# EAGLE design ch340 (EAGLE 7.7.0)
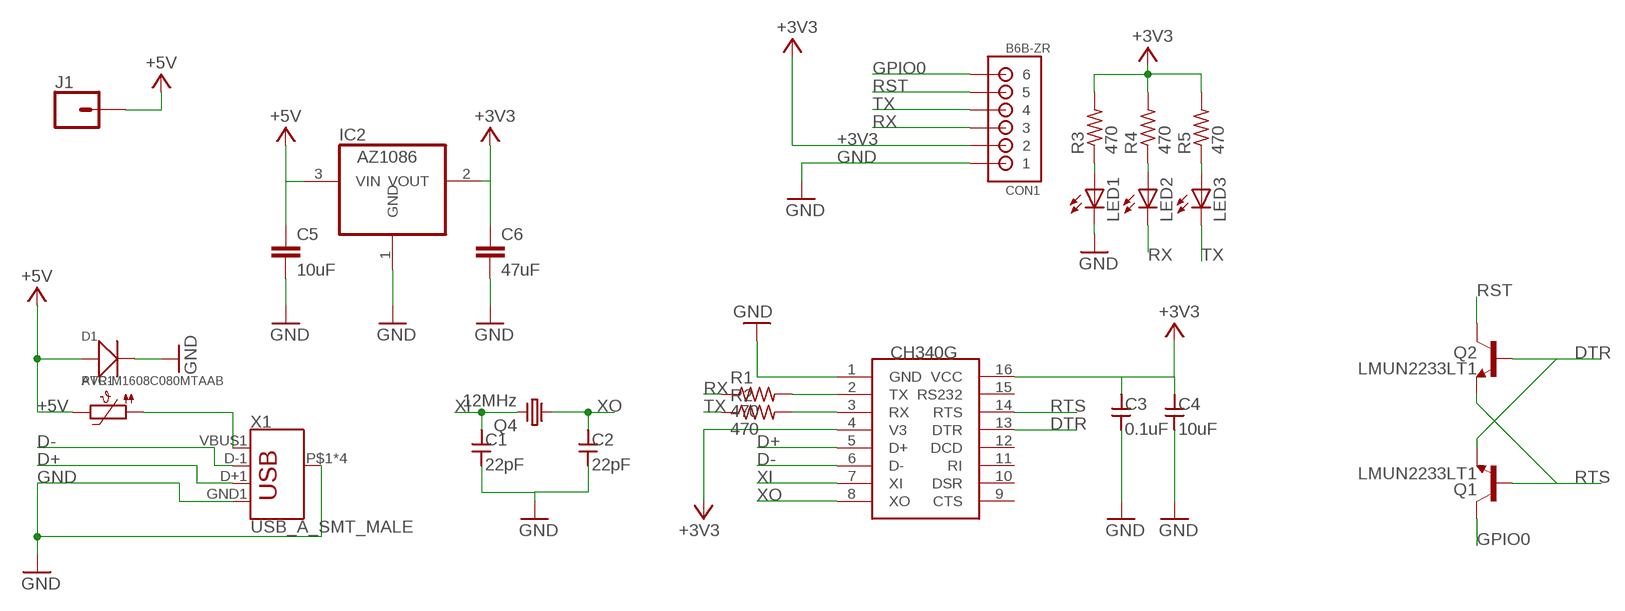
[diagram p0: schematic, sheet 1]

## Parts
C1  22pF  CAPACITOR1608  [SMD1608]
C2  22pF  CAPACITOR1608  [SMD1608]
C3  0.1uF  CAPACITOR1608  [SMD1608]
C4  10uF  CAPACITOR1608  [SMD1608]
C5  10uF  C-EUC0805  [C0805]
C6  47uF  C-EUC0805  [C0805]
CON1  B6B-ZR  [B6B-ZR]
D1  AVR-M1608C080MTAAB  DIODETUMD2  [TUMD2]
IC2  AZ1086  [SOT223]
J1  CONN_01PTH_NO_SILK_YES_STOP  [1X01_NO_SILK]
LED1  LEDCHIP-LED0805  [CHIP-LED0805]
LED2  LEDCHIP-LED0805  [CHIP-LED0805]
LED3  LEDCHIP-LED0805  [CHIP-LED0805]
PTC1  PTC1206  [1206]
Q1  LMUN2233LT1  [SOT23-3]
Q2  LMUN2233LT1  [SOT23-3]
Q4  12MHz  CRYSTAL-TC26H  [TC26H]
R1  470  R-US_R0603  [R0603]
R2  470  R-US_R0603  [R0603]
R3  470  R-US_R0603  [R0603]
R4  470  R-US_R0603  [R0603]
R5  470  R-US_R0603  [R0603]
U$1  CH340G  [SOIC16]
X1  USB_A_SMT_MALE  [USB-A-SMT-MALE]

## Nets
+3V3 [vcc]: C3.1 C4.1 C6.1 CON1.2 IC2.2(VOUT) R3.2 R4.2 R5.2 U$1.4(V3) U$1.16(VCC)
+5V [vcc]: C5.1 D1.+ IC2.3(VIN) J1.1 PTC1.2
D+: U$1.5(D+) X1.D+1(D+)
D-: U$1.6(D-) X1.D-1(D-)
DTR: Q1.3(E) Q2.1(B) U$1.13(DTR)
GND [gnd]: C1.2 C2.2 C3.2 C4.2 C5.2 C6.2 CON1.1 D1.- IC2.1(GND) LED1.C U$1.1(GND) X1.GND1(GND) X1.P$1(SHIELD) X1.P$2(SHIELD) X1.P$3(SHIELD) X1.P$4(SHIELD)
GPIO0: CON1.6 Q1.2(C)
N$1 [vcc]: PTC1.1 X1.VBUS1(VBUS)
N$2: LED1.A R3.1
N$3: LED2.A R4.1
N$4: LED3.A R5.1
RST: CON1.5 Q2.2(C)
RTS: Q1.1(B) Q2.3(E) U$1.14(RTS)
RX: CON1.3 LED2.C R1.1
RXD: R2.2 U$1.3(RX)
TX: CON1.4 LED3.C R2.1
TXD: R1.2 U$1.2(TX)
XI: C1.1 Q4.2 U$1.7(XI)
XO: C2.1 Q4.1 U$1.8(XO)
Unconnected: U$1.9(CTS) U$1.10(DSR) U$1.11(RI) U$1.12(DCD) U$1.15(RS232)

## Library data of the parts
C1-C4 = generic:CAPACITOR: Generic Capacitor
C5 C6 = resistor:C-EU: CAPACITOR, European symbol
CON1 = jst-zh:B6B-ZR: JST-ZH Connector 6 pol, 1.5mm pitch Package: B6B-ZR Source: http://www.jst-mfg.com/product/pdf/eng/eZH.pdf
D1 = for-esp32-breakout:DIODE*
IC2 = akizuki:AZ1086: 1.5A LOW DROPOUT LINEAR REGULATOR 1.8V, 2.5V, 2.85V, 3.3V, 5V, and Adj; MPN: AZ1086
J1 = SparkFun-Connectors:CONN_01: Single connection point. Often used as Generic Header-pin footprint for 0.1 inch spaced/style header connections On any of the 0.1 inch spaced packages, you can populate with these: Break Away Headers - Straight <https://www.sparkfun.com/products/116> (PRT-00116) Break Away Male Headers - Right Angle <https://www.sparkfun.com/products/553> (PRT-00553) Female Headers <https://www.sparkfun.com/products/115> (PRT-00115) Break Away Headers - Machine Pin <https://www.sparkfun.com/products/117> (PRT-00117) Break Away Female Headers - Swiss Machine Pin <https://www.sparkfun.com/products/743> (PRT-00743) This device is also useful as a general connection point to wire up your design to another part of your project. Our various solder wires solder well into these plated through hole pads. Hook-Up Wire - Assortment (Stranded, 22 AWG) <https://www.sparkfun.com/products/11375> (PRT-11375) Hook-Up Wire - Assortment (Solid Core, 22 AWG) <https://www.sparkfun.com/products/11367> (PRT-11367) View the entire wire category on our website here <https://www.sparkfun.com/categories/141> Special notes: SMTSO-256-ET is a "flush mount" nut for a 4-40 screw. We mostly use this on specialty testbeds; it is a nice way to connect hardware to your PCB at an adjustable hieght. Also note, the SNAP packages are for using a snappable style connector. We sell a baggie of snaps and they are also used on two LilyPad designs: Snap Assortment - 30 pack (male and female) <https://www.sparkfun.com/products/11347> (DEV-11347) LilyPad Arduino SimpleSnap <https://www.sparkfun.com/products/10941> (DEV-10941) LilyPad SimpleSnap Protoboard <https://www.sparkfun.com/products/10940> (DEV-10940)
LED1-LED3 = adafruit:LED: LED OSRAM: - CHIPLED LG R971, LG N971, LY N971, LG Q971, LY Q971, LO R971, LY R971 LH N974, LH R974 LS Q976, LO Q976, LY Q976 LO Q996 - Hyper CHIPLED LW Q18S LB Q993, LB Q99A, LB R99A - SideLED LS A670, LO A670, LY A670, LG A670, LP A670 LB A673, LV A673, LT A673, LW A673 LH A674 LY A675 LS A676, LA A676, LO A676, LY A676, LW A676 LS A679, LY A679, LG A679 - Hyper Micro SIDELED® LS Y876, LA Y876, LO Y876, LY Y876 LT Y87S - SmartLED LW L88C, LW L88S LB L89C, LB L89S, LG L890 LS L89K, LO L89K, LY L89K LS L896, LA L896, LO L896, LY L896 - TOPLED LS T670, LO T670, LY T670, LG T670, LP T670 LSG T670, LSP T670, LSY T670, LOP T670, LYG T670 LG T671, LOG T671, LSG T671 LB T673, LV T673, LT T673, LW T673 LH T674 LS T676, LA T676, LO T676, LY T676, LB T676, LH T676, LSB T676, LW T676 LB T67C, LV T67C, LT T67C, LS T67K, LO T67K, LY T67K, LW E67C LS E67B, LA E67B, LO E67B, LY E67B, LB E67C, LV E67C, LT E67C LW T67C LS T679, LY T679, LG T679 LS T770, LO T770, LY T770, LG T770, LP T770 LB T773, LV T773, LT T773, LW T773 LH T774 LS E675, LA E675, LY E675, LS T675 LS T776, LA T776, LO T776, LY T776, LB T776 LHGB T686 LT T68C, LB T68C - Hyper Mini TOPLED® LB M676 - Mini TOPLED Santana® LG M470 LS M47K, LO M47K, LY M47K Source: http://www.osram.convergy.de/
PTC1 = microbuilder:PTC: PTC (Resettable Fuse) 1206 Package 250mA PTC (16V Max, Time-to-Trip: 0.08s) - Digikey: F2110CT-ND 1210 Package 100mA PTC (30V Max, Time-to-Trip: 0.6s) - Digikey: MF-USMF010-2CT-ND 1812 Package 750mA PTC (24V Max, Time-to-Trip: 0.2s) - Digikey: MF-MSMF075/24-2CT-ND
Q1 Q2 = for-esp-wroom-02:LMUN2233LT1
Q4 = crystal:CRYSTAL-: CRYSTAL
R1-R5 = resistor:R-US_: RESISTOR, American symbol
U$1 = ch340g:CH340G
X1 = aitendo:USB_A: USB-A Connector Male and female variants, as well as PTH and SMT variants SparkFun Products: SparkFun XBee Explorer Dongle <https://www.sparkfun.com/products/11697> PTH Male SparkFun MicroView-USB Programmer <https://www.sparkfun.com/products/12924> SMT Male SparkFun USB Type A Female Breakout <https://www.sparkfun.com/products/12700> SMT Female; PROD_ID: CONN-11499

## Net classes
0 default: width 0.254 mm, drill 0.305 mm, clearance 0.152 mm
1 gnd: width 0.635 mm, drill 0.635 mm, clearance 0.254 mm
2 vcc: width 0.813 mm, drill 0.813 mm, clearance 0.254 mm

## Board
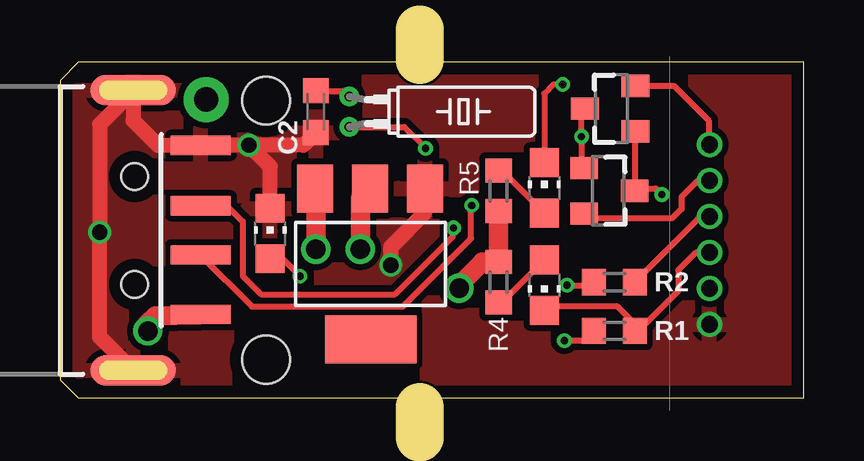
[diagram p1: board, top side]
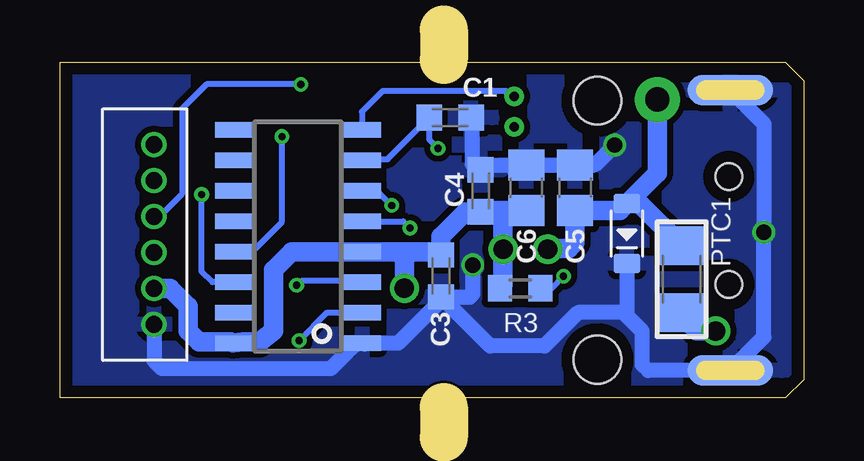
[diagram p2: board, bottom side, seen from below]

Size 31 x 14 mm. Coordinates in mm from the lower left corner, seen from the top.
Outline: 0.76,0 31,0 31,14 0.76,14 0,13.24 0,0.76 0.76,0
Copper layers (1*16): Top 0.035mm / dielectric 1.6mm / Bottom 0.035mm
Design rules "Elecrow_2-layer_PCB_eagle_rule": minimum track width 6mil, minimum drill 12mil, track to track 6mil, track to pad 6mil, pad to pad 6mil, via to via 8mil, smd to smd 0mil, copper to edge 20mil, drill to drill 10mil, minimum pad ring 6mil, minimum via ring 6mil, stop-mask expansion 0mil, vias tented up to drill 100mil, thermal gap 10mil
Holes 2 mm at 8.59,12.4 8.59,1.6
tRestrict: 2 lines
bRestrict: 2 lines
Milling: 2 lines

### Footprints (pad centres in the part's own frame; a part is rotated, then mirrored left to right if it is on the bottom)
SMD1608 = smd 1.05 x 1.08: 1 -0.875,0; 2 0.875,0
C0805 = smd 1.3 x 1.5: 1 -0.95,0; 2 0.95,0
B6B-ZR = drill 0.7: 1 9,-1.3; 2 7.5,-1.3; 3 6,-1.3; 4 4.5,-1.3; 5 3,-1.3; 6 1.5,-1.3
TUMD2 = smd 0.8 x 1.1: + -1.25,0; - 1.25,0
SOT223 = smd 1.499 x 2.007: 1 -2.261,-3.15; 2 0.025,-3.15; 3 2.311,-3.15 | smd 3.81 x 2.007: 4 0,3.15
1X01_NO_SILK = drill 1.016 pad 1.88: 1 0,0
CHIP-LED0805 = smd 1.2 x 1.2: A 0,-1.05; C 0,1.05
1206 = smd 1.6 x 1.8: 1 -1.4,0; 2 1.4,0
SOT23-3 = smd 0.927 x 1.154: 1 -0.95,-1; 2 0.95,-1; 3 0,1.1
TC26H = drill 0.406 pad 0.813: 1 -0.635,0; 2 0.635,0
R0603 = smd 1 x 1.1: 1 -0.85,0; 2 0.85,0
SOIC16 = smd 0.635 x 1.524: 1 -4.445,-2.695; 2 -3.175,-2.695; 3 -1.905,-2.695; 4 -0.635,-2.695; 5 0.635,-2.695; 6 1.905,-2.695; 7 3.175,-2.695; 8 4.445,-2.695; 9 4.445,2.695; 10 3.175,2.695; 11 1.905,2.695; 12 0.635,2.695; 13 -0.635,2.695; 14 -1.905,2.695; 15 -3.175,2.695; 16 -4.445,2.695
USB-A-SMT-MALE = smd 2.5 x 0.8: D+1 10.95,1.027; D-1 10.95,-1.027; GND1 10.95,3.551; VBUS1 10.95,-3.5 | smd 3.556 x 1.27: P$1 8.128,5.842; P$3 8.128,-5.842 | smd 3.556 x 1.27 bottom: P$2 8.128,5.842; P$4 8.128,-5.842 | hole 1.1: 8.2,2.25; 8.2,-2.25

### Placement (x,y rotation side)
C1  14.73,11.68 0 bottom
C2  10.67,11.94 270 top
C3  15.11,5.08 270 bottom
C4  13.46,8.64 90 bottom
C5  9.53,8.76 90 bottom
C6  11.56,8.76 90 bottom
CON1  25.78,12.06 270 bottom
D1  7.37,6.86 270 bottom
IC2  12.95,5.59 180 top
J1  6.1,12.45 0 top
LED1  8.76,6.86 0 top
LED2  20.19,4.7 180 top
LED3  20.19,8.76 0 top
PTC1  5.08,4.95 90 bottom
Q1  22.99,12.06 90 top
Q2  22.86,8.64 270 top
Q4  12.06,11.94 270 top
R1  23.11,2.79 180 top
R2  23.11,4.83 180 top
R3  11.81,4.57 180 bottom
R4  18.29,4.83 90 top
R5  18.29,8.64 270 top
U$1  21.08,6.73 90 bottom
X1  -5.08,6.99 0 top

### Tracks (layer width: path | path; a pad name or v marks a point on that pad's centre or on a via)
+3V3  (via drill 0.81)
  Top 0.813: R5.2 R4.2 17.61,5.68 16.64,4.7 v16.64,4.57 | IC2.2 12.52,8.33 v12.52,6.2
  Bottom 0.813: CON1.2 26.41,4.57 25.65,3.81 25.65,2.79 25.2,2.34 23.88,2.34 U$1.16 23.37,2.34 22.68,2.34 22.1,2.79 22.1,5.33 21.34,6.1 U$1.4 | C6.1 12.45,7.81 | 12.45,7.81 13.28,7.81 C4.1 13.48,7.75 14.1,7.75 15.11,6.73 C3.1 15.25,6.1 16.51,6.1 | R3.2 12.52,4.71 v12.52,6.2 12.52,7.74 12.45,7.81 | U$1.4 16.51,6.1 | U$1.4 17.14,6.1 | v16.64,4.57 16.64,5.97 16.51,6.1
+5V  (via drill 0.81)
  Top 0.813: v10.67,6.2 10.67,8.23 IC2.3
  Bottom 0.813: v10.67,6.2 10.64,6.22 9.78,6.22 9.53,6.48 C5.1 7.66,7.81 D1.+ | J1.1 6.1,9.38 D1.+ | D1.+ 6.83,8.11 PTC1.2
D+  (via drill 0.3)
  Top 0.254: X1.D+1 6.97,8.01 7.62,7.37 7.62,5.08 8.38,4.32 13.97,4.32 16.38,6.73 16.38,7.06 v16.41,7.09
  Bottom 0.254: U$1.5 16.69,7.37 v16.41,7.09
D-  (via drill 0.3)
  Top 0.254: v17.17,8.03 17.14,8 17.14,6.66 14.3,3.81 8,3.81 5.87,5.94 X1.D-1
  Bottom 0.254: U$1.6 17.78,8.64 v17.17,8.03
DTR  (via drill 0.3)
  Top 0.254: 21.84,11.99 Q1.3 21.74,11.92 v21.74,10.9 21.74,9.7 Q2.1
  Bottom 0.254: U$1.13 22.99,6.1 21.74,7.34 v21.74,10.9
GND  (via drill 0.64)
  Top 0.635: 5.23,10.57 5.79,10.57 | 5.79,10.57 X1.GND1 4.06,10.54 3.05,11.56 3.05,12.8 | X1.P$1 3.05,12.8 | 5.79,10.57 7.85,10.57 v7.87,10.54 | C2.2 10.15,10.54 v7.87,10.54 | LED1.C 8.76,9.65 v7.87,10.54 | IC2.1 15.21,7.72 13.79,6.3 v13.79,5.54 | X1.P$4 1.65,2.54 v1.65,6.91 1.65,11.4 3.05,12.8
  Bottom 0.635: 18.29,2.23 U$1.1 | U$1.1 18.69,2.23 19.71,1.22 26.75,1.22 27.08,1.55 CON1.1 | 7.37,3.43 7.49,3.56 9.4,3.56 10.79,2.16 13.07,2.16 C3.2 | 7.37,3.43 6.73,2.79 6.73,1.4 6.48,1.14 X1.P$4 1.65,2.54 v1.65,6.91 1.65,11.43 X1.P$1 | C6.2 C5.2 8.7,9.71 v7.87,10.54 | 12.01,9.38 C6.2 | 11.76,9.51 C6.2 | C6.2 13.26,9.71 C4.2 13.82,9.74 13.82,11.64 C1.2 | v13.79,5.54 13.79,4.32 13.9,4.21 C3.2 | C3.2 15.11,4.06 16.89,2.29 U$1.1 | D1.- 7.37,3.43
  pour Top: 0,13.21 0,0.89 0,0.76 0.76,0 30.86,0 30.86,13.97 0.76,13.97
  pour Bottom: 0,13.21 0,0.76 0.76,0 30.86,0 30.86,13.97 0.76,13.97
GPIO0
  Top 0.254: Q1.2 25.59,13.02 27.05,11.56 27.05,10.6 CON1.6
N$1  (via drill 0.81)
  Top 0.813: X1.VBUS1 5.79,3.45 3.99,3.43 3.66,3.1 v3.66,2.79
  Bottom 0.813: PTC1.1 5.08,3.43 4.45,2.79 v3.66,2.79
N$2  (via drill 0.3)
  Top 0.254: 8.76,5.94 LED1.A 9.28,5.81 v10.01,5.08
  Bottom 0.254: R3.1 10.52,4.57 v10.01,5.08
N$3
  Top 0.254: R4.1 18.67,4.23 LED2.A
N$4
  Top 0.254: R5.1 18.38,9.4 18.51,9.4 LED3.A 20.16,7.75 20.07,7.75
RST
  Top 0.254: Q2.2 21.95,7.82 22.28,7.49 25.53,7.49 25.91,7.87 25.91,8.38 26.59,9.06 CON1.5
RTS  (via drill 0.3)
  Top 0.254: Q1.1 24.08,11.07 23.96,10.96 Q2.3 23.98,8.74 24.84,8.74 v25.09,8.48
  Bottom 0.254: U$1.14 24.64,4.83 25.09,5.28 v25.09,8.48
RX
  Top 0.254: CON1.3 26.51,6.07 25.78,5.33 25.78,4.46 24.11,2.79 R1.1 23.96,3.09 23.24,3.81 20.35,3.81 LED2.C
RXD  (via drill 0.3)
  Top 0.254: 21.88,4.45 R2.2 22.14,4.7 v21.13,4.7
  Bottom 0.254: U$1.3 18.39,4.88 20.95,4.88 v21.13,4.7
TX  (via drill 0.3)
  Top 0.254: v20.95,13.08 20.57,13.08 20.19,12.7 LED3.C | 23.96,4.91 R2.1 26.7,7.57 CON1.4
  Bottom 0.254: v20.95,13.08 24.89,13.08 25.91,12.06 25.91,8.51 26.85,7.57 CON1.4
TXD  (via drill 0.3)
  Top 0.254: R1.2 21.86,2.39 v21.03,2.39
  Bottom 0.254: v21.03,2.39 19.86,3.56 U$1.2
XI  (via drill 0.3)
  Top 0.254: Q4.2 14.35,11.3 v15.24,10.41
  Bottom 0.254: U$1.7 18.29,9.96 17.33,9.96 C1.1 15.61,10.78 v15.24,10.41
XO
  Top 0.254: C2.1 10.87,12.8 11.79,12.8 Q4.1
  Bottom 0.254: 12.39,12.8 12.45,12.8 | 12.45,12.8 17.55,12.8 18.41,11.94 18.41,11.2 U$1.8 | Q4.1 12.22,12.57 12.45,12.8

### Text on the board
tValues: IO0 | RST | TX | RX | 3V3 | GND | Rev.3
bValues: 5V | IO0 | RST | TX | RX | 3V3 | GND